# Altium schematic sheet Sheet2-edgy.SchDoc
size A4
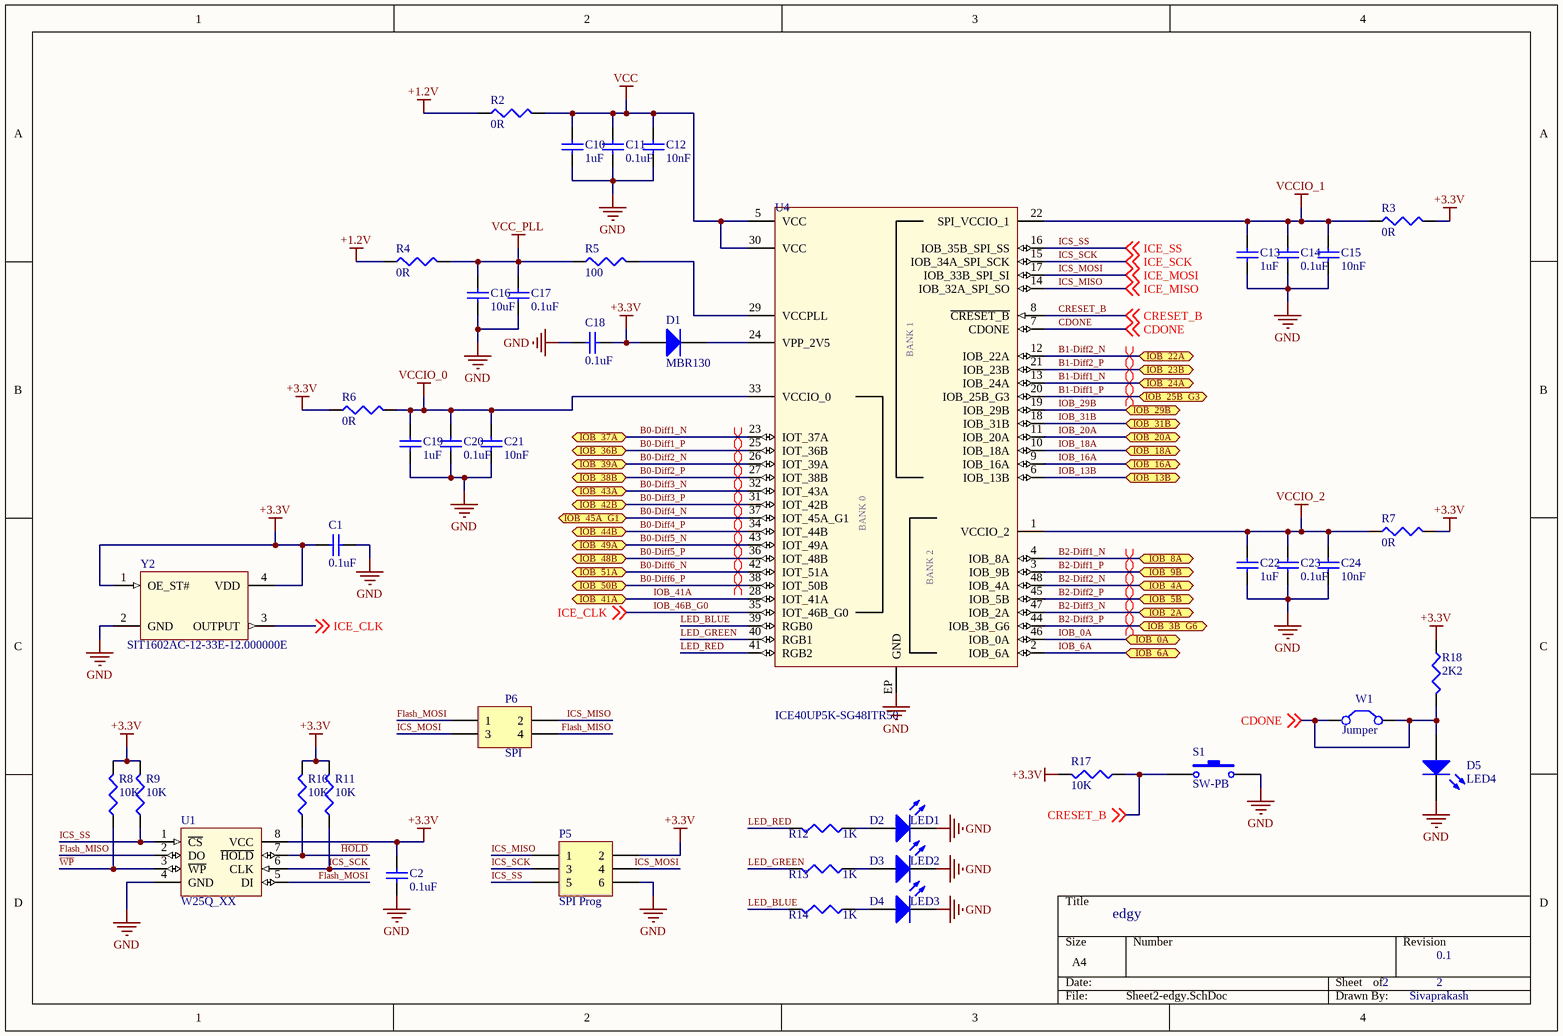
[diagram p0: Sheet2-edgy.SchDoc]

## Parts
C1  0.1uF  [1608[0603]]
C2  0.1uF  [1608[0603]]
C10  1uF  [1608[0603]]
C11  0.1uF  [1608[0603]]
C12  10nF  [1608[0603]]
C13  1uF  [1608[0603]]
C14  0.1uF  [1608[0603]]
C15  10nF  [1608[0603]]
C16  10uF  [1608[0603]]
C17  0.1uF  [1608[0603]]
C18  0.1uF  [1608[0603]]
C19  1uF  [1608[0603]]
C20  0.1uF  [1608[0603]]
C21  10nF  [1608[0603]]
C22  1uF  [1608[0603]]
C23  0.1uF  [1608[0603]]
C24  10nF  [1608[0603]]
D1  MBR130  [SOD_123]
D2  LED1  [1608[0603]]
D3  LED2  [1608[0603]]
D4  LED3  [1608[0603]]
D5  LED4  [1608[0603]]
P5  SPI Prog  [2x3_2.54mm_pitch_header]
P6  SPI  [2x2_2.54mm_pitch_header]
R2  0R  [J1-0603]
R3  0R  [J1-0603]
R4  0R  [J1-0603]
R5  100  [J1-0603]
R6  0R  [J1-0603]
R7  0R  [J1-0603]
R8  10K  [J1-0603]
R9  10K  [J1-0603]
R10  10K  [J1-0603]
R11  10K  [J1-0603]
R12  1K  [J1-0603]
R13  1K  [J1-0603]
R14  1K  [J1-0603]
R17  10K  [J1-0603]
R18  2K2  [J1-0603]
S1  SW-PB  [Tact_Switch]
U1  W25Q_XX  [SOIC-8_3.9x4.9mm_pitch1.27mm]
U4  ICE40UP5K-SG48ITR50  [*QFN50P700X700X100-49N_ICE40UP5K-SG48ITR50(Primary)]
W1  Jumper  [0402]
Y2  SIT1602AC-12-33E-12.000000E  [*OSCDFN320X250X80-4N]

## Ports
IOB_0A (bidir), IOB_2A (bidir), IOB_3B_G6 (bidir), IOB_4A (bidir), IOB_5B (bidir), IOB_6A (bidir), IOB_8A (bidir), IOB_9B (bidir), IOB_13B (bidir), IOB_16A (bidir), IOB_18A (bidir), IOB_20A (bidir), IOB_22A (bidir), IOB_23B (bidir), IOB_24A (bidir), IOB_25B_G3 (bidir), IOB_29B (bidir), IOB_31B (bidir), IOB_36B (bidir), IOB_37A (bidir), IOB_38B (bidir), IOB_39A (bidir), IOB_41A (bidir), IOB_42B (bidir), IOB_43A (bidir), IOB_44B (bidir), IOB_45A_G1 (bidir), IOB_48B (bidir), IOB_49A (bidir), IOB_50B (bidir), IOB_51A (bidir)

## Nets
+1.2V: R2.1 R4.1
+3.3V: C1.2 C2.2 C18.1 D1.1(A) P5.2 R3.1 R6.1 R7.1 R8.1 R9.1 R10.1 R11.1 R17.2 R18.1 U1.8(VCC) Y2.1(OE_ST#) Y2.4(VDD)
GND: C1.1 C2.1 C10.1 C11.1 C12.1 C13.1 C14.1 C15.1 C16.1 C17.1 C18.2 C19.1 C20.1 C21.1 C22.1 C23.1 C24.1 D2.2(K) D3.2(K) D4.2(K) D5.2(K) P5.6 S1.2 U1.4(GND) U4.EP(GND) Y2.2(GND)
VCC: C10.2 C11.2 C12.2 R2.2 U4.5(VCC) U4.30(VCC)
VCC_PLL: C16.2 C17.2 R4.2 R5.1
VCCIO_0: C19.2 C20.2 C21.2 R6.2 U4.33(VCCIO_0)
VCCIO_1: C13.2 C14.2 C15.2 R3.2 U4.22(SPI_VCCIO_1)
VCCIO_2: C22.2 C23.2 C24.2 R7.2 U4.1(VCCIO_2)
~{HOLD}: R10.2 U1.7(~{HOLD})
~{WP}: R8.2 U1.3(~{WP})
B0-Diff1_N: U4.23(IOT_37A) ; port IOB_37A
B0-Diff1_P: U4.25(IOT_36B) ; port IOB_36B
B0-Diff2_N: U4.26(IOT_39A) ; port IOB_39A
B0-Diff2_P: U4.27(IOT_38B) ; port IOB_38B
B0-Diff3_N: U4.32(IOT_43A) ; port IOB_43A
B0-Diff3_P: U4.31(IOT_42B) ; port IOB_42B
B0-Diff4_N: U4.37(IOT_45A_G1) ; port IOB_45A_G1
B0-Diff4_P: U4.34(IOT_44B) ; port IOB_44B
B0-Diff5_N: U4.43(IOT_49A) ; port IOB_49A
B0-Diff5_P: U4.36(IOT_48B) ; port IOB_48B
B0-Diff6_N: U4.42(IOT_51A) ; port IOB_51A
B0-Diff6_P: U4.38(IOT_50B) ; port IOB_50B
B1-Diff1_N: U4.13(IOB_24A) ; port IOB_24A
B1-Diff1_P: U4.20(IOB_25B_G3) ; port IOB_25B_G3
B1-Diff2_N: U4.12(IOB_22A) ; port IOB_22A
B1-Diff2_P: U4.21(IOB_23B) ; port IOB_23B
B2-Diff1_N: U4.4(IOB_8A) ; port IOB_8A
B2-Diff1_P: U4.3(IOB_9B) ; port IOB_9B
B2-Diff2_N: U4.48(IOB_4A) ; port IOB_4A
B2-Diff2_P: U4.45(IOB_5B) ; port IOB_5B
B2-Diff3_N: U4.47(IOB_2A) ; port IOB_2A
B2-Diff3_P: U4.44(IOB_3B_G6) ; port IOB_3B_G6
CDONE: D5.1(A) R18.2 U4.7(CDONE) W1.1(C1) W1.2(C2) ; off-sheet CDONE
CRESET_B: R17.1 S1.1 U4.8(~{CRESET_B}) ; off-sheet CRESET_B
Flash_MISO: P6.4 U1.2(DO)
Flash_MOSI: P6.1 U1.5(DI)
ICS_MISO: P5.1 P6.2 U4.14(IOB_32A_SPI_SO) ; off-sheet ICE_MISO  [also labelled ICE_MISO]
ICS_MOSI: P5.4 P6.3 U4.17(IOB_33B_SPI_SI) ; off-sheet ICE_MOSI  [also labelled ICE_MOSI]
ICS_SCK: P5.3 R11.2 U1.6(CLK) U4.15(IOB_34A_SPI_SCK) ; off-sheet ICE_SCK  [also labelled ICE_SCK]
ICS_SS: P5.5 R9.2 U1.1(~{CS}) U4.16(IOB_35B_SPI_SS) ; off-sheet ICE_SS  [also labelled ICE_SS]
IOB_0A: U4.46(IOB_0A) ; port IOB_0A
IOB_6A: U4.2(IOB_6A) ; port IOB_6A
IOB_13B: U4.6(IOB_13B) ; port IOB_13B
IOB_16A: U4.9(IOB_16A) ; port IOB_16A
IOB_18A: U4.10(IOB_18A) ; port IOB_18A
IOB_20A: U4.11(IOB_20A) ; port IOB_20A
IOB_29B: U4.19(IOB_29B) ; port IOB_29B
IOB_31B: U4.18(IOB_31B) ; port IOB_31B
IOB_41A: U4.28(IOT_41A) ; port IOB_41A
IOB_46B_G0: U4.35(IOT_46B_G0) Y2.3(OUTPUT) ; off-sheet ICE_CLK  [also labelled ICE_CLK]
LED_BLUE: R14.2 U4.39(RGB0)
LED_GREEN: R13.2 U4.40(RGB1)
LED_RED: R12.2 U4.41(RGB2)
NetD1_2: D1.2(K) U4.24(VPP_2V5)
NetD2_1: D2.1(A) R12.1
NetD3_1: D3.1(A) R13.1
NetD4_1: D4.1(A) R14.1
NetR5_2: R5.2 U4.29(VCCPLL)

## Layout directives
differential pair: B0-Diff1_N, B0-Diff1_P, B0-Diff2_N, B0-Diff2_P, B0-Diff3_N, B0-Diff3_P, B0-Diff4_N, B0-Diff4_P, B0-Diff5_N, B0-Diff5_P, B0-Diff6_N, B0-Diff6_P, B1-Diff1_N, B1-Diff1_P, B1-Diff2_N, B1-Diff2_P, B2-Diff1_N, B2-Diff1_P, B2-Diff2_N, B2-Diff2_P, B2-Diff3_N, B2-Diff3_P

## Notes on the sheet
- edgy
- 2
- 0.1
- Sivaprakash
- (in symbol ICE40UP5K-SG48ITR50) BANK 1; BANK 0; BANK 2

## Library data of the parts
C1 C2 C10-C24 = Cap Semi: Capacitor (Semiconductor SIM Model); Published: 8-Jun-2000; LatestRevisionDate: 29-May-2009; LatestRevisionNote: IPC-7351 Footprint Added.; PackageReference: C1206; Publisher: Altium Limited; PackageDescription: Chip Capacitor
D1 = Diode: Default Diode; Published: 8-Jun-2000; LatestRevisionDate: 17-Jul-2002; LatestRevisionNote: Re-released for DXP Platform.; PackageVersion: Sep-1996; PackageReference: SMC; Publisher: Altium Limited; PackageDescription: DO-214-AB/SMC; 2 C-Bend Leads; Body 7.9 x 5.9 mm, inc. leads (LxW); Code_JEDEC: DO-214-AB
D2-D5 = LED3: Typical BLUE SiC LED; Published: 8-Jun-2000; LatestRevisionDate: 17-Dec-2003; LatestRevisionNote: PCB Footprint replaced.; DatasheetVersion: 16-Apr-2002; PackageVersion: 16-Apr-2002; PackageReference: 3.5X2.8X1.9; Publisher: Altium Limited; PackageDescription: SM LED; 2 C-Bend Leads; Body 3.5 x 2.8 x 1.9 mm, inc leads (LxWxH typ)
P5 = Header 3X2: Header, 3-Pin, Dual row; LatestRevisionDate: 17-Jul-2002; LatestRevisionNote: Re-released for DXP Platform.; Publisher: Altium Limited
P6 = Header 2X2: Header, 2-Pin, Dual row; LatestRevisionDate: 17-Jul-2002; LatestRevisionNote: Re-released for DXP Platform.; Publisher: Altium Limited
R2-R14 R17 R18 = Res3: Resistor; Published: 8-Jun-2000; LatestRevisionDate: 29-May-2009; LatestRevisionNote: IPC-7351 Footprint Added.; PackageReference: J1-0603; Publisher: Altium Limited; PackageDescription: Chip Resistor
S1 = SW-PB: Switch; Published: 24-Mar-1999; LatestRevisionDate: 17-Jul-2002; LatestRevisionNote: Re-released for DXP Platform.; PackageReference: SPST-2; Publisher: Altium Limited; PackageDescription: Switch; 2 Leads
U4 = ICE40UP5K-SG48ITR50: iCE40 UltraPlusÂ™ 5280 LUTs 39 I/O 1.2 V Surface Mount FOPGA - QFN-48; MF: Lattice Semiconductor; MP: ICE40UP5K-SG48ITR50; Digi-Key_Part_Number: 220-2145-1-ND; Package: QFN-48 Lattice Semiconductor; SnapEDA_Link: https://www.snapeda.com/parts/ICE40UP5K-SG48ITR50/Lattice%20Semiconductor%20Corporation/view-part/?ref=snap; Digi-Key_Purchase_URL: https://www.digikey.in/product-detail/en/lattice-semiconductor-corporation/ICE40UP5K-SG48ITR50/220-2145-1-ND/7688199?utm_source=snapeda&utm_medium=aggregator&utm_campaign=symbol; Value: *
W1 = Jumper: Jumper Wire; Published: 24-Mar-1999; LatestRevisionDate: 17-Jul-2002; LatestRevisionNote: Re-released for DXP Platform.; PackageReference: RAD-0.2; Publisher: Altium Limited; PackageDescription: Radial Cap, Thru-Hole; 2 Leads; 0.2 in Pin Spacing
Y2 = SIT1602AC-12-33E-12.000000E: Manufacturer: SiTime; Supplier 1: Digi-Key; Manufacturer Part Number: SIT1602AC-12-33E-12.000000E; Stock 1: 0; Pricing 1: 1000=0.63648 (USD); Mount: Surface Mount; Case/Package: SMD/SMT; Packaging: Tape and Reel; Length: 0.098inch; Height: 0.032inch; Width: 0.079inch; Supplier Part Number 1: SIT1602AC-12-33E-12.000000E-ND